# EAGLE design untitled (EAGLE 4.16)
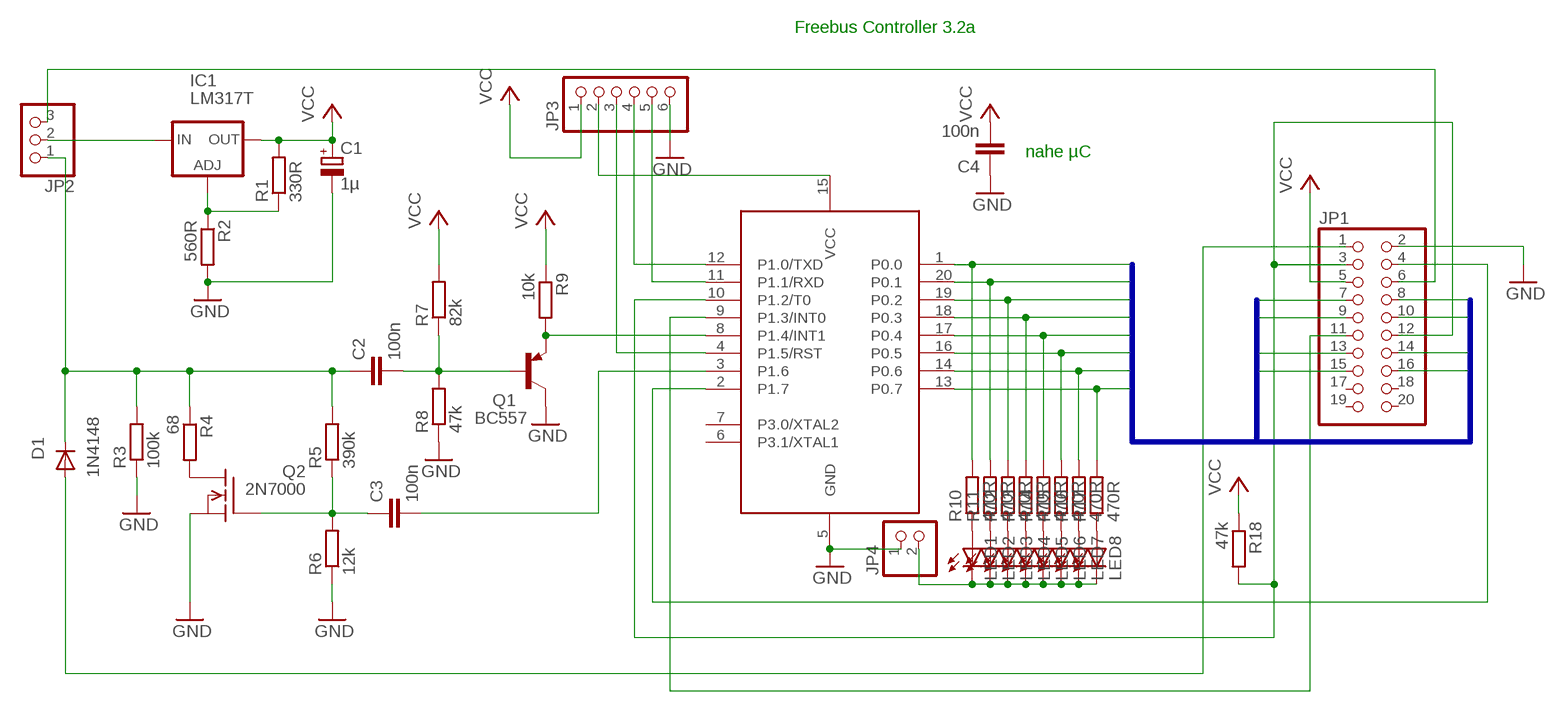
[diagram p0: schematic, sheet 1]

## Parts
C1  1µ  CPOL-EUE2.5-5  [E2,5-5]
C2  100n  C-EU050-024X044  [C050-024X044]
C3  100n  C-EU050-024X044  [C050-024X044]
C4  100n  C-EU050-024X044  [C050-024X044]
D1  1N4148  [DO35-10]
IC1  LM317T  LM317L  [317L]
JP1  PINHD-2X10  [2X10]
JP2  PINHD-1X3  [1X03]
JP3  PINHD-1X6  [1X06]
JP4  PINHD-1X2  [1X02]
LED1  LED3MM  [LED3MM]
LED2  LED3MM  [LED3MM]
LED3  LED3MM  [LED3MM]
LED4  LED3MM  [LED3MM]
LED5  LED3MM  [LED3MM]
LED6  LED3MM  [LED3MM]
LED7  LED3MM  [LED3MM]
LED8  LED3MM  [LED3MM]
Q1  BC557  [TO92]
Q2  2N7000  VN2222KM  [TO237]
R1  330R  R-EU_0207/10  [0207/10]
R2  560R  R-EU_0207/10  [0207/10]
R3  100k  R-EU_0207/10  [0207/10]
R4  68  R-EU_0207/10  [0207/10]
R5  390k  R-EU_0207/10  [0207/10]
R6  12k  R-EU_0207/10  [0207/10]
R7  82k  R-EU_0207/10  [0207/10]
R8  47k  R-EU_0207/10  [0207/10]
R9  10k  R-EU_0207/10  [0207/10]
R10  470R  R-EU_0207/10  [0207/10]
R11  470R  R-EU_0207/10  [0207/10]
R12  470R  R-EU_0207/10  [0207/10]
R13  470R  R-EU_0207/10  [0207/10]
R14  470R  R-EU_0207/10  [0207/10]
R15  470R  R-EU_0207/10  [0207/10]
R16  470R  R-EU_0207/10  [0207/10]
R17  470R  R-EU_0207/10  [0207/10]
R18  47k  R-EU_0207/10  [0207/10]
U1  89LPC922  [DIL20]

## Nets
GND: C1.- C4.1 JP1.2 JP3.6 JP4.1 Q1.3(C) Q2.3(S) R2.2 R3.1 R6.1 R8.1 U1.5(GND)
N$1: Q1.1(E) R9.2 U1.8(P1.4/INT1)
N$2: C2.2 Q1.2(B) R7.1 R8.2
N$3: JP1.11 U1.9(P1.3/INT0)
N$5: C3.2 U1.3(P1.6)
N$6: Q2.1(D) R4.2
N$7: IC1.1(ADJ) R1.1 R2.1
N$9: C2.1 D1.C JP2.1 R3.2 R4.1 R5.2
N$16: D1.A JP1.1
N$17: JP1.4 U1.2(P1.7)
N$18: IC1.3(IN) JP2.2
N$19: JP1.6 JP2.3
N$20: LED1.A R10.1
N$21: LED2.A R11.1
N$22: LED3.A R12.1
N$23: LED4.A R13.1
N$24: LED5.A R14.1
N$25: LED6.A R15.1
N$26: LED7.A R16.1
N$27: LED8.A R17.1
N$28: JP4.2 LED1.K(C) LED2.K(C) LED3.K(C) LED4.K(C) LED5.K(C) LED6.K(C) LED7.K(C) LED8.K(C)
N$29: JP3.4 U1.12(P1.0/TXD)
N$30: JP3.5 U1.11(P1.1/RXD)
N$31: JP3.3 U1.4(P1.5/RST)
N$32: JP3.2 U1.15(VCC)
N$33: JP1.3 JP1.12 R18.2 U1.10(P1.2/T0)
N$34: C3.1 Q2.2(G) R5.1 R6.2
P0.0: JP1.7 R10.2 U1.1(P0.0)
P0.1: JP1.8 R11.2 U1.20(P0.1)
P0.2: JP1.9 R12.2 U1.19(P0.2)
P0.3: JP1.10 R13.2 U1.18(P0.3)
P0.4: JP1.13 R14.2 U1.17(P0.4)
P0.5: JP1.14 R15.2 U1.16(P0.5)
P0.6: JP1.15 R16.2 U1.14(P0.6)
P0.7: JP1.16 R17.2 U1.13(P0.7)
VCC: C1.+ C4.2 IC1.2(OUT) JP1.5 JP3.1 R1.2 R7.2 R9.1 R18.1
Unconnected: JP1.17 JP1.18 JP1.19 JP1.20 U1.6(P3.1/XTAL1) U1.7(P3.0/XTAL2)

## Buses
P0.[0..7]

## Notes on the sheet
- Freebus Controller 3.2a
- nahe µC

## Library data of the parts
C1 = rcl:CPOL-EU: POLARIZED CAPACITOR, European symbol
C2-C4 = rcl:C-EU: CAPACITOR, European symbol
D1 = diode:1N4148: DIODE high speed (Philips)
IC1 = v-reg:LM317L: VOLTAGE REGULATOR
JP1 = pinhead:PINHD-2X10: PIN HEADER
JP2 = pinhead:PINHD-1X3: PIN HEADER
JP3 = pinhead:PINHD-1X6: PIN HEADER
JP4 = pinhead:PINHD-1X2: PIN HEADER
LED1-LED8 = led:LED: LED OSRAM: - CHIPLED LG R971, LG N971, LY N971, LG Q971, LY Q971, LO R971, LY R971 LH N974, LH R974 LS Q976, LO Q976, LY Q976 LO Q996 - Hyper CHIPLED LW Q18S LB Q993, LB Q99A, LB R99A - SideLED LS A670, LO A670, LY A670, LG A670, LP A670 LB A673, LV A673, LT A673, LW A673 LH A674 LY A675 LS A676, LA A676, LO A676, LY A676, LW A676 LS A679, LY A679, LG A679 - Hyper Micro SIDELED® LS Y876, LA Y876, LO Y876, LY Y876 LT Y87S - SmartLED LW L88C, LW L88S LB L89C, LB L89S, LG L890 LS L89K, LO L89K, LY L89K LS L896, LA L896, LO L896, LY L896 - TOPLED LS T670, LO T670, LY T670, LG T670, LP T670 LSG T670, LSP T670, LSY T670, LOP T670, LYG T670 LG T671, LOG T671, LSG T671 LB T673, LV T673, LT T673, LW T673 LH T674 LS T676, LA T676, LO T676, LY T676, LB T676, LH T676, LSB T676, LW T676 LB T67C, LV T67C, LT T67C, LS T67K, LO T67K, LY T67K, LW E67C LS E67B, LA E67B, LO E67B, LY E67B, LB E67C, LV E67C, LT E67C LW T67C LS T679, LY T679, LG T679 LS T770, LO T770, LY T770, LG T770, LP T770 LB T773, LV T773, LT T773, LW T773 LH T774 LS E675, LA E675, LY E675, LS T675 LS T776, LA T776, LO T776, LY T776, LB T776 LHGB T686 LT T68C, LB T68C - Hyper Mini TOPLED® LB M676 - Mini TOPLED Santana® LG M470 LS M47K, LO M47K, LY M47K Source: http://www.osram.convergy.de - LUMILED® LXK2-PW12-R00, LXK2-PW12-S00, LXK2-PW14-U00, LXK2-PW14-V00 LXK2-PM12-R00, LXK2-PM12-S00, LXK2-PM14-U00 LXK2-PE12-Q00, LXK2-PE12-R00, LXK2-PE12-S00, LXK2-PE14-T00, LXK2-PE14-U00 LXK2-PB12-K00, LXK2-PB12-L00, LXK2-PB12-M00, LXK2-PB14-N00, LXK2-PB14-P00, LXK2-PB14-Q00 LXK2-PR12-L00, LXK2-PR12-M00, LXK2-PR14-Q00, LXK2-PR14-R00 LXK2-PD12-Q00, LXK2-PD12-R00, LXK2-PD12-S00 LXK2-PH12-R00, LXK2-PH12-S00 LXK2-PL12-P00, LXK2-PL12-Q00, LXK2-PL12-R00 Source: www.luxeon.com
Q1 = transistor-pnp:BC557: PNP Transistor
Q2 = transistor-fet:VN2222KM: N-Channel Enhancement MOSFET (VMOS); 60V; 0,5A; 7,5Ohm
R1-R18 = rcl:R-EU_: RESISTOR, European symbol
U1 = micro-philips:89LPC922

## Board
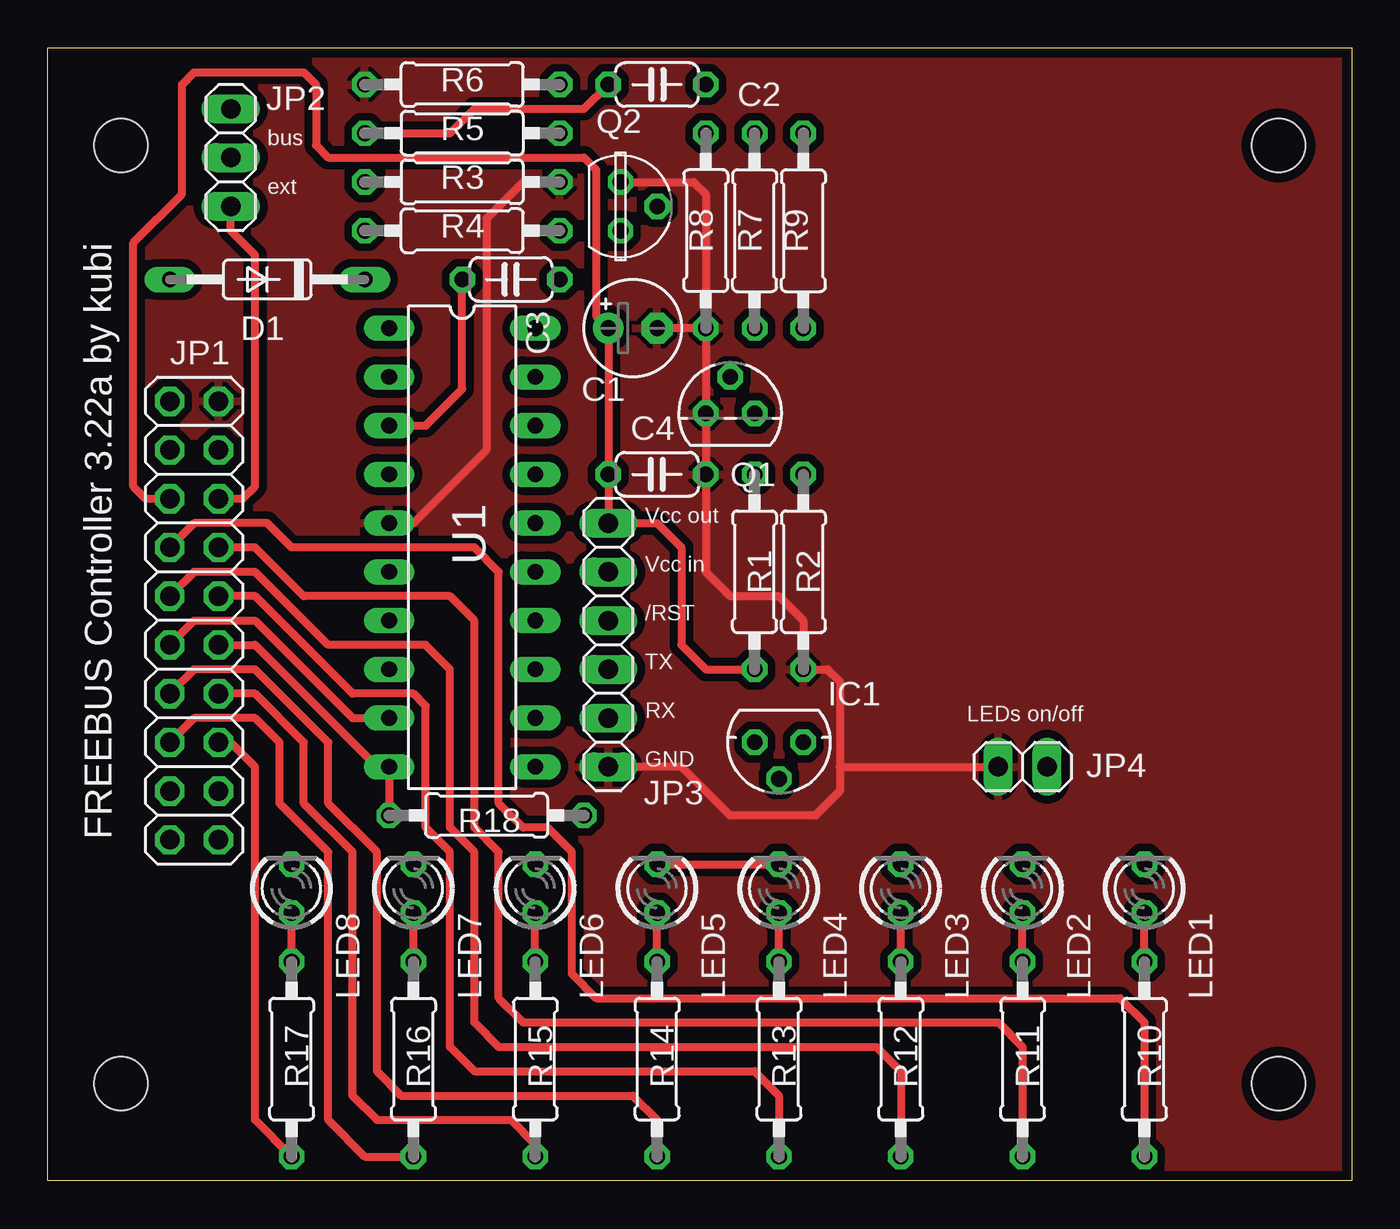
[diagram p1: board, top side]
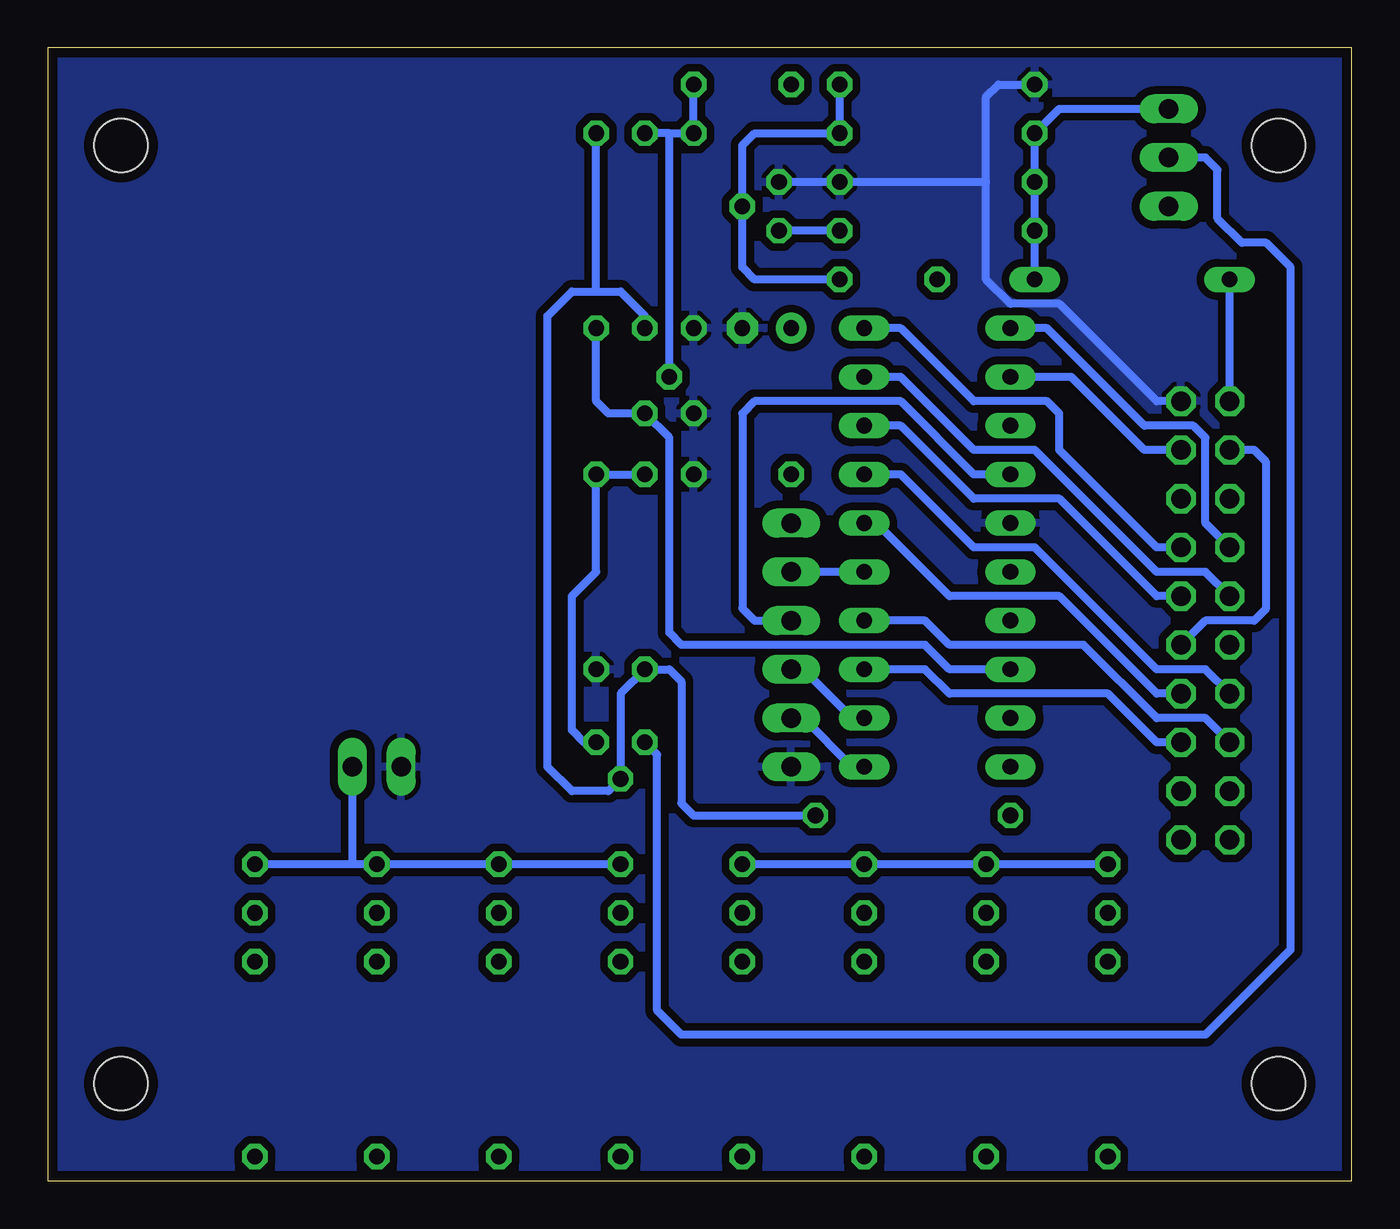
[diagram p2: board, bottom side, seen from below]

Size 67.94 x 59.05 mm. Coordinates in mm from the lower left corner, seen from the top.
Outline: 0,0 0,59.05 67.94,59.05 67.94,0 0,0
Copper layers (1*16): Top 0.035mm / dielectric 1.5mm / Bottom 0.035mm
Design rules "default": minimum track width 10mil, minimum drill 24mil, track to track 16mil, track to pad 12mil, pad to pad 16mil, via to via 16mil, smd to smd 8mil, copper to edge 20mil, drill to drill 8mil, minimum pad ring 10mil, minimum via ring 8mil, stop-mask expansion 4mil, vias tented up to drill 0mil, thermal gap 10mil
Holes 2.8 mm at 3.81,53.98 64.14,53.98 64.14,5.08 3.81,5.08

### Footprints (pad centres in the part's own frame; a part is rotated, then mirrored left to right if it is on the bottom)
E2,5-5 = drill 0.813 pad 1.6 round: + -1.27,0 | drill 0.813 pad 1.6 octagon: - 1.27,0
C050-024X044 = drill 0.813 octagon: 1 -2.54,0; 2 2.54,0
DO35-10 = drill 0.813 long: A 5.08,0; C -5.08,0
317L = drill 0.813 octagon: 1 -1.27,0; 2 0,1.905; 3 1.27,0
2X10 = drill 1.016 octagon: 1 -11.43,-1.27; 2 -11.43,1.27; 3 -8.89,-1.27; 4 -8.89,1.27; 5 -6.35,-1.27; 6 -6.35,1.27; 7 -3.81,-1.27; 8 -3.81,1.27; 9 -1.27,-1.27; 10 -1.27,1.27; 11 1.27,-1.27; 12 1.27,1.27; 13 3.81,-1.27; 14 3.81,1.27; 15 6.35,-1.27; 16 6.35,1.27; 17 8.89,-1.27; 18 8.89,1.27; 19 11.43,-1.27; 20 11.43,1.27
1X03 = drill 1.016 long: 1 -2.54,0; 2 0,0; 3 2.54,0
1X06 = drill 1.016 long: 1 -6.35,0; 2 -3.81,0; 3 -1.27,0; 4 1.27,0; 5 3.81,0; 6 6.35,0
1X02 = drill 1.016 long: 1 -1.27,0; 2 1.27,0
LED3MM = drill 0.813 octagon: A -1.27,0; K 1.27,0
TO92 = drill 0.813 octagon: 1 1.27,0; 2 0,1.905; 3 -1.27,0
TO237 = drill 0.813 octagon: 1 1.27,0; 2 0,1.905; 3 -1.27,0
0207/10 = drill 0.813 octagon: 1 -5.08,0; 2 5.08,0
DIL20 = drill 0.813 long: 1 -11.43,-3.81; 2 -8.89,-3.81; 3 -6.35,-3.81; 4 -3.81,-3.81; 5 -1.27,-3.81; 6 1.27,-3.81; 7 3.81,-3.81; 8 6.35,-3.81; 9 8.89,-3.81; 10 11.43,-3.81; 11 11.43,3.81; 12 8.89,3.81; 13 6.35,3.81; 14 3.81,3.81; 15 1.27,3.81; 16 -1.27,3.81; 17 -3.81,3.81; 18 -6.35,3.81; 19 -8.89,3.81; 20 -11.43,3.81

### Placement (x,y rotation side)
C1  30.48,44.45 0 top
C2  31.75,57.15 0 top
C3  24.13,46.99 180 top
C4  31.75,36.83 180 top
D1  11.43,46.99 180 top
IC1  38.1,22.86 180 top
JP1  7.62,29.21 270 top
JP2  9.53,53.34 270 top
JP3  29.21,27.94 270 top
JP4  50.8,21.59 0 top
LED1  57.15,15.24 90 top
LED2  50.8,15.24 90 top
LED3  44.45,15.24 90 top
LED4  38.1,15.24 90 top
LED5  31.75,15.24 90 top
LED6  25.4,15.24 90 top
LED7  19.05,15.24 90 top
LED8  12.7,15.24 90 top
Q1  35.56,40.01 0 top
Q2  29.84,50.8 270 top
R1  36.83,31.75 270 top
R2  39.37,31.75 270 top
R3  21.59,52.07 180 top
R4  21.59,49.53 0 top
R5  21.59,54.61 180 top
R6  21.59,57.15 0 top
R7  36.83,49.53 270 top
R8  34.29,49.53 90 top
R9  39.37,49.53 270 top
R10  57.15,6.35 270 top
R11  50.8,6.35 270 top
R12  44.45,6.35 270 top
R13  38.1,6.35 270 top
R14  31.75,6.35 270 top
R15  25.4,6.35 270 top
R16  19.05,6.35 270 top
R17  12.7,6.35 270 top
R18  22.86,19.05 180 top
U1  21.59,33.02 270 top

### Tracks (layer width: path | path; a pad name or v marks a point on that pad's centre or on a via)
GND
  Top 0.406: R8.1 Q1.3 C4.1 34.29,31.75 35.56,30.48 38.1,30.48 39.37,29.21 R2.2 40.64,26.67 41.27,26.04 41.27,21.59 | Q2.3 33.66,52.07 34.29,51.44 R8.1 | U1.5 19.05,34.29 22.86,38.1 22.86,50.16 24.77,52.07 R3.1 | JP3.6 33.02,21.59 35.56,19.05 40.01,19.05 41.27,20.32 41.27,21.59 | R8.1 C1.- | 41.27,21.59 JP4.1
  Bottom 0.406: JP1.2 10.16,40.64 15.24,45.72 17.78,45.72 19.05,46.99 19.05,52.07 | 19.05,52.07 19.05,56.52 18.41,57.15 R6.1 | 19.05,52.07 R3.1 Q2.3
  pour Bottom: 0.64,0.64 0.64,58.42 67.31,58.42 67.31,0.64
  pour Top: 0.64,0.64 0.64,58.42 67.31,58.42 67.31,0.64
N$1
  Bottom 0.406: R9.2 39.37,40.64 38.73,40.01 Q1.1 35.56,38.73 35.56,28.57 34.92,27.94 22.23,27.94 20.95,26.67 U1.8
N$2
  Bottom 0.406: C2.2 R8.2 35.56,54.61 | 35.56,54.61 R7.1 | Q1.2 35.56,54.61
N$3
  Top 0.406: U1.9 15.88,24.13 10.79,29.21 7.62,29.21 JP1.11
N$5
  Top 0.406: U1.3 19.68,39.37 21.59,41.27 C3.2
N$6
  Bottom 0.406: R4.2 Q2.1
N$7
  Bottom 0.406: R1.1 R2.1 39.37,31.75 40.64,30.48 40.64,23.5 40.01,22.86 IC1.1
N$9
  Top 0.406: R5.2 20.95,54.61 22.23,55.88 27.94,55.88 C2.1
  Bottom 0.406: JP2.1 15.24,55.88 R5.2 R3.2 R4.1 D1.C
N$16
  Bottom 0.406: JP1.1 D1.A
N$17
  Bottom 0.406: JP1.4 10.79,38.1 14.61,41.91 U1.2
N$18
  Bottom 0.406: JP2.2 7.62,53.34 6.99,52.7 6.99,50.16 5.71,48.9 4.45,48.9 3.17,47.62 3.17,12.06 7.62,7.62 34.92,7.62 36.2,8.89 36.2,22.23 IC1.3
N$19
  Top 0.406: JP1.6 10.16,35.56 10.79,36.2 10.79,48.26 9.53,49.53 JP2.3
N$20
  Top 0.406: R10.1 LED1.A
N$21
  Top 0.406: R11.1 LED2.A
N$22
  Top 0.406: R12.1 LED3.A
N$23
  Top 0.406: R13.1 LED4.A
N$24
  Top 0.406: R14.1 LED5.A
N$25
  Top 0.406: R15.1 LED6.A
N$26
  Top 0.406: R16.1 LED7.A
N$27
  Top 0.406: R17.1 LED8.A
N$28
  Top 0.406: LED5.K LED4.K
  Bottom 0.406: LED8.K LED7.K LED6.K LED5.K | LED4.K LED3.K LED2.K 52.07,16.51 | 52.07,16.51 LED1.K | 52.07,16.51 JP4.2
N$29
  Bottom 0.406: U1.12 26.04,24.13 28.57,26.67 JP3.4
N$30
  Bottom 0.406: U1.11 26.04,21.59 28.57,24.13 JP3.5
N$31
  Bottom 0.406: U1.4 19.68,36.83 23.5,40.64 31.11,40.64 31.75,40.01 31.75,29.84 31.11,29.21 JP3.3
N$32
  Bottom 0.406: U1.15 JP3.2
N$33
  Top 0.406: JP1.12 10.79,27.94 17.14,21.59 U1.10 R18.2
  Bottom 0.406: JP1.12 7.62,29.21 5.08,29.21 4.45,29.84 4.45,37.47 5.08,38.1 JP1.3
N$34
  Bottom 0.406: R6.2 R5.1 31.11,54.61 31.75,53.98 Q2.2 31.75,47.62 31.11,46.99 C3.1
P0.0
  Top 0.406: R10.2 57.15,8.26 55.88,9.53 28.57,9.53 27.3,10.79 27.3,17.14 26.04,18.41 24.77,18.41 23.5,19.68 23.5,31.75 22.23,33.02 12.7,33.02 11.43,34.29 7.62,34.29 JP1.7
  Bottom 0.406: JP1.7 7.62,34.29 7.62,38.73 8.26,39.37 10.79,39.37 15.88,44.45 U1.1
P0.1
  Top 0.406: R11.2 50.8,6.99 49.53,8.26 24.77,8.26 23.5,9.53 23.5,17.14 22.23,18.41 22.23,29.21 20.95,30.48 13.34,30.48 10.79,33.02 JP1.8
  Bottom 0.406: JP1.8 10.16,33.02 15.24,38.1 15.24,40.01 15.88,40.64 19.68,40.64 23.5,44.45 U1.20
P0.2
  Top 0.406: R12.2 44.45,5.71 43.18,6.99 23.5,6.99 22.23,8.26 22.23,17.14 20.95,18.41 20.95,26.67 19.68,27.94 14.61,27.94 10.79,31.75 7.62,31.75 JP1.9
  Bottom 0.406: JP1.9 7.62,31.75 10.16,31.75 16.51,38.1 19.68,38.1 23.5,41.91 U1.19
P0.3
  Top 0.406: R13.2 38.1,4.45 36.83,5.71 22.23,5.71 20.95,6.99 20.95,17.14 19.68,18.41 19.68,24.77 19.05,25.4 15.88,25.4 10.79,30.48 JP1.10
  Bottom 0.406: U1.18 23.5,39.37 19.68,35.56 15.24,35.56 10.16,30.48 JP1.10
P0.4
  Top 0.406: R14.2 31.75,3.17 30.48,4.45 18.41,4.45 17.14,5.71 17.14,17.14 14.61,19.68 14.61,22.86 10.79,26.67 7.62,26.67 JP1.13
  Bottom 0.406: JP1.13 7.62,26.67 10.16,26.67 16.51,33.02 19.68,33.02 23.5,36.83 U1.17
P0.5
  Top 0.406: R15.2 25.4,1.91 24.13,3.17 17.14,3.17 15.88,4.45 15.88,17.14 13.34,19.68 13.34,22.86 10.79,25.4 JP1.14
  Bottom 0.406: U1.16 24.77,34.29 20.95,30.48 15.24,30.48 10.16,25.4 JP1.14
P0.6
  Top 0.406: R16.2 16.51,1.27 14.61,3.17 14.61,17.14 12.06,19.68 12.06,22.86 10.79,24.13 7.62,24.13 JP1.15
  Bottom 0.406: JP1.15 7.62,24.13 10.16,24.13 13.97,27.94 20.95,27.94 22.23,29.21 U1.14
P0.7
  Top 0.406: JP1.16 9.53,22.86 10.79,21.59 10.79,3.17 R17.2
  Bottom 0.406: U1.13 22.23,26.67 20.95,25.4 12.7,25.4 10.16,22.86 JP1.16
VCC
  Top 0.406: R1.2 34.29,26.67 33.02,27.94 33.02,33.02 31.75,34.29 JP3.1 C4.2 C1.+ 28.57,45.09 28.57,52.7 27.94,53.34 14.61,53.34 13.97,53.98 13.97,57.15 13.34,57.78 7.62,57.78 6.99,57.15 6.99,51.44 4.45,48.9 4.45,36.2 5.08,35.56 JP1.5
  Bottom 0.406: R7.2 36.83,45.09 38.1,46.35 39.37,46.35 | 39.37,46.35 40.64,46.35 41.91,45.09 41.91,21.59 40.64,20.32 38.73,20.32 IC1.2 38.1,25.4 R1.2 35.56,26.67 34.92,26.04 34.92,19.68 34.29,19.05 R18.1 | 39.37,46.35 R9.1

### Text on the board
tPlace: bus | ext | FREEBUS Controller 3.22a by kubi | Vcc out | Vcc in | /RST | TX | LEDs on/off | RX | GND